# Altium project Power_Clock_proto.PrjPcb
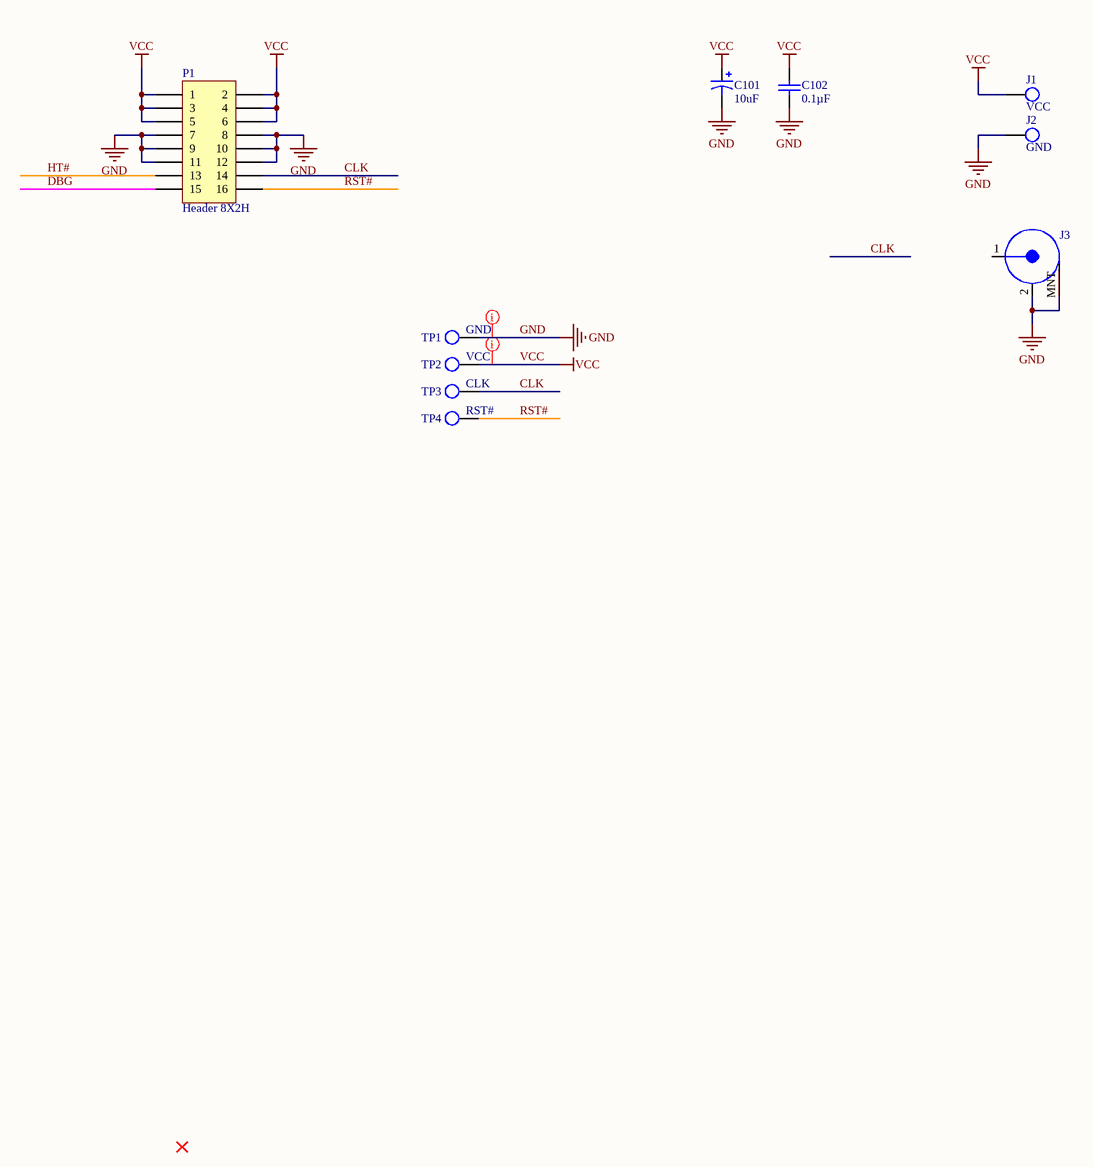
[diagram p0: Sheet1.SchDoc]
2 sheets, 28 parts. Net scope: strictly hierarchical (ports join the sheet entries above them; power ports are local).
Board file: Power_Clock_proto.PcbDoc
Sheets:
  Sheet1.SchDoc
  Sheet3.SchDoc

## Sheet Sheet1.SchDoc
size B; Author: E. Sims; Organization: Let's Build Rockets Inc.; SheetNumber: 1; SheetTotal: 3

### Parts
C101  value 10uF  [C5x7]  (hidden comment: Cap Pol5)
C102  Capacitance: 0.1µF  [VISH-K104K15X7RF5TL2]  (hidden comment: K104K15X7RF5TL2)
J1  VCC  [CT3151SP-2]
J2  GND  [CT3151SP-0]
J3  RF  [BNC R/A]  (value not drawn)
P1  Header 8X2H  [HDR2X8H]
TP1  GND  [KSTN-5011_V]  (no BOM)
TP2  VCC  [KSTN-5011_V]  (no BOM)
TP3  CLK  [KSTN-5011_V]  (no BOM)
TP4  RST#  [KSTN-5011_V]  (no BOM)

### Nets
GND: C101.2 C102.2 J2.1 J3.2 J3.MNT P1.7 P1.8 P1.9 P1.10 P1.11 P1.12 TP1.1
VCC: C101.1 C102.1 J1.1 P1.1 P1.2 P1.3 P1.4 P1.5 P1.6 TP2.1
CLK: P1.14 TP3.1
DBG: P1.15
HT#: P1.13
RST#: P1.16 TP4.1

Not connected (* = marked no-connect by the designer): J3 1

### Layout directives
rule Width Constraint [Pref Width = 20mil    Min Width = 20mil    Max Width = 50mil]; rule Routing Via Style [Pref Size = 35mil    Pref Hole Size = 20mil]; net class PWR: GND, VCC

### Notes on the sheet
- Let's Build Rocket's Inc. Modular Paylaod System Based on TMP-010 Rev
  For more information visit https://github.com/LetsBuildRockets/Modular-Payload-System
  This work is licensed under CC BY-NC 4.0. To view a copy of this license, visit https://creativecommons.org/licenses/by-nc/4.0
- Title
- Size:
- Date:
- Assembly Variant:
- B
- Number:
- Time:
- Revision:
- Sheet
- of
- Author:
- File:

### Library data of the parts
C101 = Cap Pol5: Polarized Capacitor; Published: 8-Jun-2000; LatestRevisionDate: 17-Jul-2002; LatestRevisionNote: Re-released for DXP Platform.; PackageReference: POLAR0.8; Publisher: Altium Limited; PackageDescription: Polarized Capacitor; 2 Leads
C102 = CMP-2000-06508-1: Ceramic Capacitor, 100 nF, +/- 10%, 50 V, -55 to 125 degC, 2-Pin THD, RoHS, Tape and Reel; Manufacturer: Vishay; Other Names: BC1084CT; Catalog Drawings: Mono-KapSide2-15_5.58Mono-KapSide1_15; Temperature Coefficient: X7R; Voltage - Rated: 50V; Online Catalog: Mono-Kap™Series; Size / Dimension: 0.157"Lx0.098"W(4.00mmx2.50mm); Operating Temperature: -55°C~125°C; Family: CeramicCapacitors; Manufacturer URL: http://www.vishay.com/; Standard Package: 1; Thickness (Max): -; Ratings: -; Datasheet Version: 08/2013; Package Description: 2-Pin Through Hole Device, Body 4 x 2.6 mm; Mounting Type: ThroughHole; Features: -; Lead Spacing: 0.098"(2.50mm); Tolerance: ±10%; Category: Capacitors; Mounting Technology: ThroughHole; Lead Style: Straight; Datasheet URL: http://www.vishay.com/docs/45171/kseries.pdf; Applications: GeneralPurpose; Package / Case: Radial; Height - Seated (Max): 0.220"(5.58mm); Package Reference: K104K15X7RF5TL2; Series: Mono-Kap™K; Packaging: CutTape(CT)
J1 = CT3151SP-2: CONN BANANA JACK SOLDER RED; Unit Price (USD): 2.05
J2 = CT3151SP-0: CONN BANANA JACK SOLDER BLACK; Unit Price (USD): 2.05
P1 = Header 8X2H: Header, 8-Pin, Dual row, Right Angle; System: Connector; LatestRevisionDate: 17-Jul-2002; LatestRevisionNote: Re-released for DXP Platform.; Publisher: Altium Limited
TP1-TP4 = TP

## Sheet Sheet3.SchDoc
size B; Author: E. Sims; Organization: Let's Build Rockets Inc.; SheetNumber: 3; SheetTotal: 3
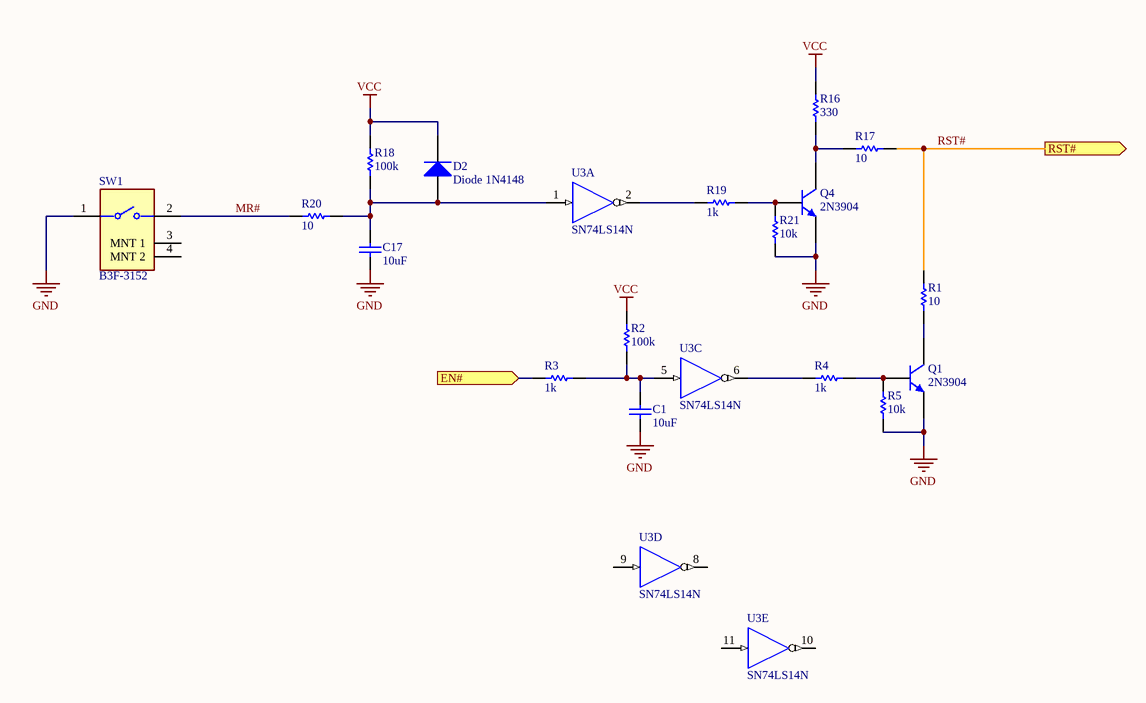
[diagram p1: Sheet3.SchDoc]

### Parts
C1  value 10uF  [RAD-0.3]  (hidden comment: Cap)
C17  value 10uF  [RAD-0.3]  (hidden comment: Cap)
D2  Diode 1N4148  [DO-35]
Q1  2N3904  [TO-92A]
Q4  2N3904  [TO-92A]
R1  value 10  [AXIAL-0.3]  (hidden comment: Res1)
R2  value 100k  [AXIAL-0.3]  (hidden comment: Res1)
R3  value 1k  [AXIAL-0.3]  (hidden comment: Res1)
R4  value 1k  [AXIAL-0.3]  (hidden comment: Res1)
R5  value 10k  [AXIAL-0.3]  (hidden comment: Res1)
R16  value 330  [AXIAL-0.3]  (hidden comment: Res1)
R17  value 10  [AXIAL-0.3]  (hidden comment: Res1)
R18  value 100k  [AXIAL-0.3]  (hidden comment: Res1)
R19  value 1k  [AXIAL-0.3]  (hidden comment: Res1)
R20  value 10  [AXIAL-0.3]  (hidden comment: Res1)
R21  value 10k  [AXIAL-0.3]  (hidden comment: Res1)
SW1  B3F-3152  [FP-B3F-3152-MFG]
U3  SN74LS14N  [N014]  (parts A,C,D,E of 6)

### Ports
EN# (in), RST# (out)

### Nets
GND: C1.1 C17.1 Q1.1(E) Q4.1(E) R5.2 R21.2 SW1.1 U3.7(GND)
VCC: D2.2(K) R2.2 R16.1 R18.2 U3.14(VCC)
MR#: R20.2 SW1.2
RST#: R1.1 R17.1 ; port RST#
NetC1_2: C1.2 R2.1 R3.1 U3.5(A)
NetC17_2: C17.2 D2.1(A) R18.1 R20.1 U3.1(A)
NetQ1_2: Q1.2(B) R4.1 R5.1
NetQ1_3: Q1.3(C) R1.2
NetQ4_2: Q4.2(B) R19.1 R21.1
NetQ4_3: Q4.3(C) R16.2 R17.2
NetR3_2: R3.2 ; port EN#
NetR4_2: R4.2 U3.6(Y)
NetR19_2: R19.2 U3.2(Y)

Not connected (* = marked no-connect by the designer): SW1 3(MNT_1) 4(MNT_2); U3 8(Y) 9(A) 10(Y) 11(A)

### Notes on the sheet
- Let's Build Rocket's Inc. Modular Paylaod System Based on TMP-010 Rev
  For more information visit https://github.com/LetsBuildRockets/Modular-Payload-System
  This work is licensed under CC BY-NC 4.0. To view a copy of this license, visit https://creativecommons.org/licenses/by-nc/4.0
- Title
- Size:
- Date:
- Assembly Variant:
- B
- Number:
- Time:
- Revision:
- Sheet
- of
- Author:
- File:

### Library data of the parts
C1 C17 = Cap: Capacitor; Published: 8-Jun-2000; LatestRevisionDate: 17-Jul-2002; LatestRevisionNote: Re-released for DXP Platform.; PackageReference: RAD-0.3; Publisher: Altium Limited; PackageDescription: Radial Cap, Thru-Hole; 2 Leads; 0.3 in Pin Spacing
D2 = Diode 1N4148: High Conductance Fast Diode; Published: 8-Jun-2000; LatestRevisionDate: 17-Jul-2002; LatestRevisionNote: Re-released for DXP Platform.; DatasheetVersion: 1997; PackageReference: DO-35; Publisher: Altium Limited; PackageDescription: Diode, Axial; Body 3.8 x 1.9 mm (LxDia. max), Lead Dia. 0.53 mm (max); Code_JEDEC: DO-204-AH; ComponentLink1Description: Manufacturer Link; ComponentLink1URL: http://www.fairchildsemi.com/; ComponentLink2Description: Datasheet; ComponentLink2URL: http://www.fairchildsemi.com/ds/1N%2F1N4148.pdf
Q1 Q4 = 2N3904: NPN General Purpose Amplifier; Published: 8-Jun-2000; LatestRevisionDate: 15-Jan-2003; LatestRevisionNote: PCB Footprint 'BCY-W3/D4.7' replaced; DatasheetVersion: 1997; PackageVersion: Sep-1998; PackageReference: TO-92A; Publisher: Altium Limited; PackageDescription: TO, Flat Index; 3 In-Line, Axial Leads; Body Dia. 4.5mm; Leads 0.51 x 0.48 mm (max); ComponentLink1Description: Manufacturer Link; ComponentLink1URL: http://www.fairchildsemi.com/; ComponentLink2Description: Datasheet; ComponentLink2URL: http://www.fairchildsemi.com/ds/2N%2F2N3904.pdf
R1-R5 R16-R21 = Res1: Resistor; Published: 8-Jun-2000; LatestRevisionDate: 17-Jul-2002; LatestRevisionNote: Re-released for DXP Platform.; PackageReference: AXIAL-0.3; Publisher: Altium Limited; PackageDescription: Axial Device, Thru-Hole; 2 Leads; 0.3 in Pin Spacing
SW1 = CMP-08834-000033-1: SWITCH TACTILE SPST-NO 0.05A 24V; Mechanical Life: 300000Cycles; Max Current Rating: 50mA; Illumination Type: Non-Illuminated; Actuator Color: Yellow; Throw Configuration: SPST; Switch Function: Off-Mom; Ratings: IP00; Switch Travel: 0.25mm; Actuator Type: PLUNGER; Contact Resistance: 100mR; Number of Poles: 1; Operating Force: 1.47N; Height: 6.15mm; Contact Plating: Gold; Contact Type: 1 maker; Termination: PC Pins; Radiation Hardening: No; Contact Material: Gold; Number of Pins: 4; Length: 7.3mm; Width: 6mm; Weight: 0.25g; Packaging: Bulk; Contact Current Rating: 50mA; Max Operating Temperature: 70°C; Lead Free: Lead Free; Mount: Through Hole; RoHS Compliant: Yes; Series: B3F; Orientation: Right Angle; Package Quantity: 1000; Current Rating: 50mA; Max Voltage Rating (DC): 24V; Min Operating Temperature: -25°C; Electrical Life: 300000Cycles; Depth: 7.15mm; Voltage Rating (DC): 24V
U3 = SN74LS14N: Hex Schmitt-Trigger Inverter; Published: 8-Jun-2000; LatestRevisionDate: 04-Mar-2005; LatestRevisionNote: Stylized 3D Model Added.; DatasheetVersion: Mar-1988; PackageVersion: Oct-1995; PackageReference: N014; Publisher: Altium Limited; PackageDescription: DIP; 14 Leads; Row Spacing 7.62 mm; Pitch 2.54 mm; ComponentLink1Description: Manufacturer Link; ComponentLink1URL: http://www.ti.com/; ComponentLink2Description: Datasheet; ComponentLink2URL: http://www-s.ti.com/sc/ds/sn74ls14.pdf